# EAGLE schematic r4 (EAGLE 8.0.1)
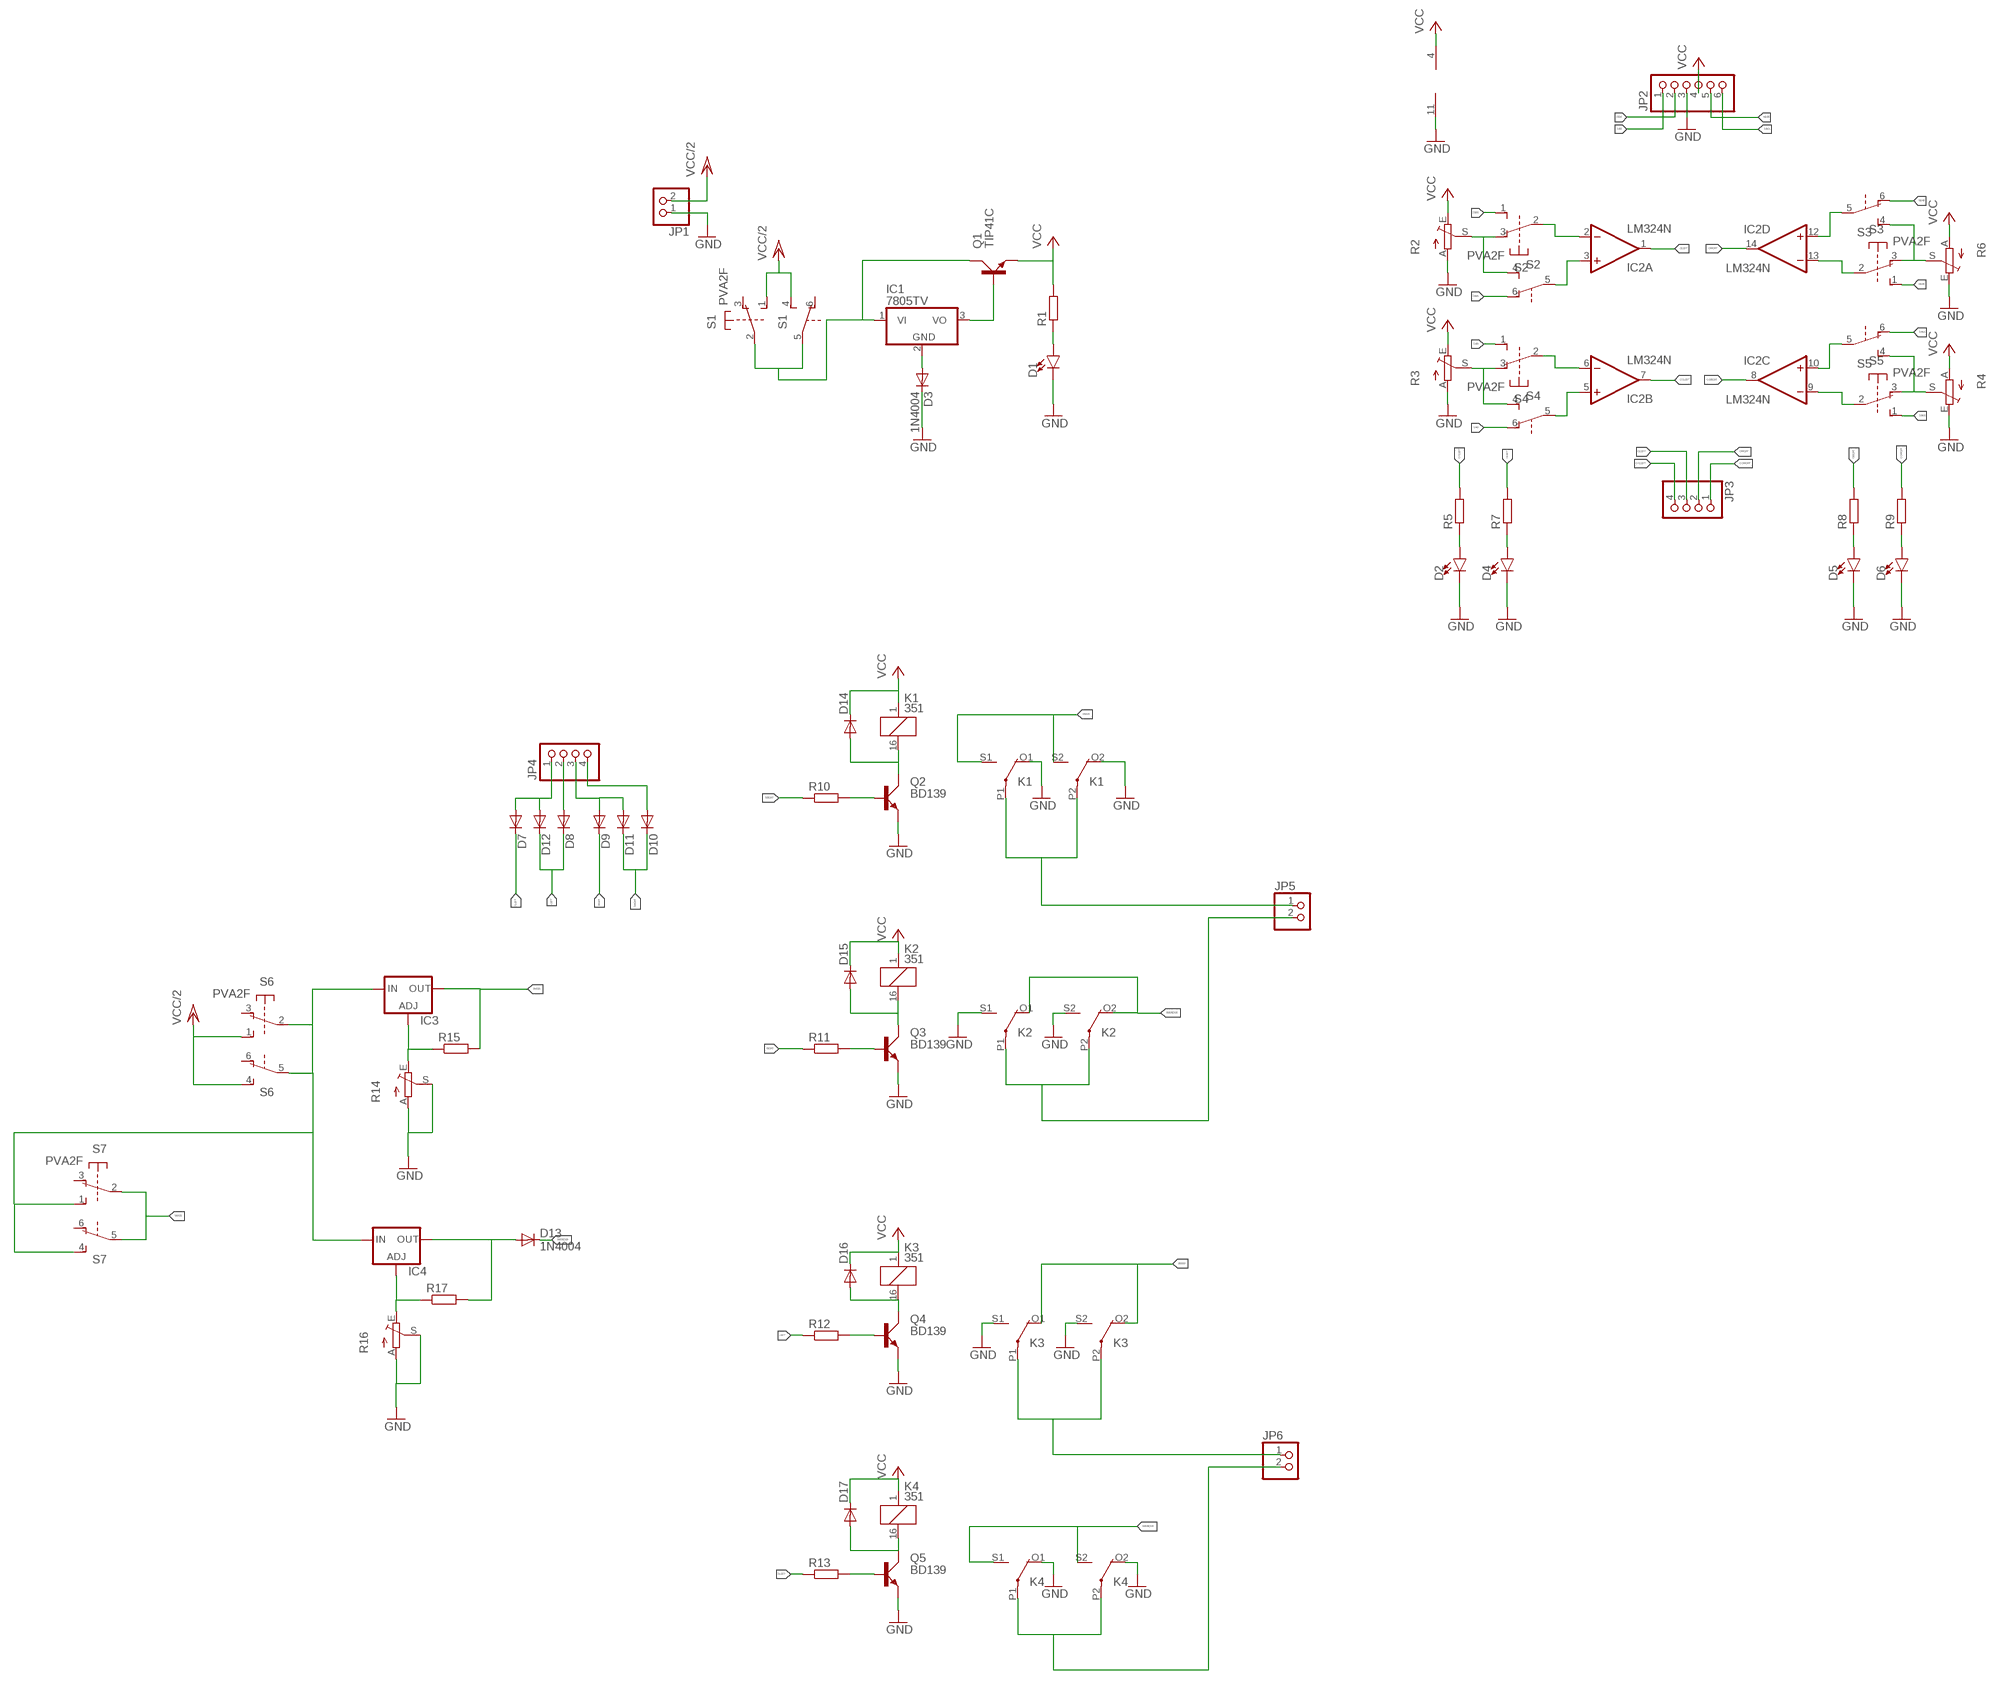
[diagram p0: schematic, sheet 1]

## Parts
D1  LED5MM  [LED_5MM]
D2  LED5MM  [LED_5MM]
D3  1N4004  [DO41-10]
D4  LED5MM  [LED_5MM]
D5  LED5MM  [LED_5MM]
D6  LED5MM  [LED_5MM]
D7  1N4148DO35-7  [DO35-7]
D8  1N4148DO35-7  [DO35-7]
D9  1N4148DO35-7  [DO35-7]
D10  1N4148DO35-7  [DO35-7]
D11  1N4148DO35-7  [DO35-7]
D12  1N4148DO35-7  [DO35-7]
D13  1N4004  [DO41-10]
D14  1N4148DO35-7  [DO35-7]
D15  1N4148DO35-7  [DO35-7]
D16  1N4148DO35-7  [DO35-7]
D17  1N4148DO35-7  [DO35-7]
IC1  7805TV  [TO220V]
IC2  LM324N  [DIL14]
IC3  LM317TS  [317TS]
IC4  LM317TS  [317TS]
JP1  PINHD-1X2  [1X02]
JP2  PINHD-1X6  [1X06]
JP3  PINHD-1X4  [1X04]
JP4  PINHD-1X4  [1X04]
JP5  PINHD-1X2  [1X02]
JP6  PINHD-1X2  [1X02]
K1  351  [351]
K2  351  [351]
K3  351  [351]
K4  351  [351]
Q1  TIP41C  [TO220AV]
Q2  BD139  [TO126AV]
Q3  BD139  [TO126AV]
Q4  BD139  [TO126AV]
Q5  BD139  [TO126AV]
R1  R-EU_0204/7  [0204/7]
R2  TRIM_EU-CA6V  [CA6V]
R3  TRIM_EU-CA6V  [CA6V]
R4  TRIM_EU-CA6V  [CA6V]
R5  R-EU_0204/7  [0204/7]
R6  TRIM_EU-CA6V  [CA6V]
R7  R-EU_0204/7  [0204/7]
R8  R-EU_0204/7  [0204/7]
R9  R-EU_0204/7  [0204/7]
R10  R-EU_0204/7  [0204/7]
R11  R-EU_0204/7  [0204/7]
R12  R-EU_0204/7  [0204/7]
R13  R-EU_0204/7  [0204/7]
R14  TRIM_EU-CA6V  [CA6V]
R15  R-EU_0204/7  [0204/7]
R16  TRIM_EU-CA6V  [CA6V]
R17  R-EU_0204/7  [0204/7]
S1  PVA2F  [PVA2F]
S2  PVA2F  [PVA2F]
S3  PVA2F  [PVA2F]
S4  PVA2F  [PVA2F]
S5  PVA2F  [PVA2F]
S6  PVA2F  [PVA2F]
S7  PVA2F  [PVA2F]

## Nets
DEKI: JP2.2 S2.1(1:S) S2.6(2:O)
GND: D1.K(C) D2.K(C) D3.C D4.K(C) D5.K(C) D6.K(C) IC2.11(P:V-) JP1.1 JP2.3 K1.O1(2:O) K1.O2(3:O) K2.S1(2:S) K2.S2(3:S) K3.S1(2:S) K3.S2(3:S) K4.O1(2:O) K4.O2(3:O) Q2.E Q3.E Q4.E Q5.E R2.A R3.A R4.E R6.E R14.A R14.S R16.A R16.S
LEFT: D8.C D12.C R12.1
N$1: D3.A IC1.2(GND)
N$2: IC1.1(VI) Q1.C S1.2(1:P) S1.5(2:P)
N$3: IC1.3(VO) Q1.B
N$4: D1.A R1.1
N$5: R2.S S2.3(1:O) S2.4(2:S)
N$6: IC2.2(A:-IN) S2.2(1:P)
N$7: IC2.3(A:+IN) S2.5(2:P)
N$8: R6.S S3.3(1:O) S3.4(2:S)
N$9: IC2.13(D:-IN) S3.2(1:P)
N$10: IC2.12(D:+IN) S3.5(2:P)
N$11: R3.S S4.3(1:O) S4.4(2:S)
N$12: IC2.6(B:-IN) S4.2(1:P)
N$13: IC2.5(B:+IN) S4.5(2:P)
N$14: R4.S S5.3(1:O) S5.4(2:S)
N$15: IC2.9(C:-IN) S5.2(1:P)
N$16: IC2.10(C:+IN) S5.5(2:P)
N$17: D2.A R5.1
N$18: D4.A R7.1
N$19: D5.A R8.1
N$20: D6.A R9.1
N$21: D7.A D12.A JP4.1
N$22: D8.A JP4.2
N$23: D9.A D11.A JP4.3
N$24: D10.A JP4.4
N$25: Q2.B R10.2
N$26: Q3.B R11.2
N$27: Q4.B R12.2
N$28: Q5.B R13.2
N$29: D14.A K1.16 Q2.C
N$30: IC3.1(ADJ) R14.E R15.1
N$31: IC4.1(ADJ) R16.E R17.1
N$32: D15.A K2.16 Q3.C
N$34: D16.A K3.16 Q4.C
N$35: JP5.1 K1.P1(2:P) K1.P2(3:P)
N$36: JP5.2 K2.P1(2:P) K2.P2(3:P)
N$37: D17.A K4.16 Q5.C
N$38: JP6.1 K3.P1(2:P) K3.P2(3:P)
N$39: JP6.2 K4.P1(2:P) K4.P2(3:P)
N$40: D13.A IC4.2(OUT) R17.2
N$41: IC3.3(IN) IC4.3(IN) S6.2(1:P) S6.5(2:P) S7.1(1:S) S7.4(2:S)
N$48: JP2.5 S3.1(1:S) S3.6(2:O)
OLEFT: IC2.1(A:OUT) JP3.3 R7.2
ORIGHT: IC2.14(D:OUT) JP3.2 R8.2
OSLEFT: IC2.7(B:OUT) JP3.4 R5.2
OSRIGHT: IC2.8(C:OUT) JP3.1 R9.2
RIGHT: D9.C R11.1
SAKA: JP2.6 S5.1(1:S) S5.6(2:O)
SAKI: JP2.1 S4.1(1:S) S4.6(2:O)
SLEFT: D7.C R13.1
SRIGHT: D10.C D11.C R10.1
VCC: D14.C D15.C D16.C D17.C IC2.4(P:V+) JP2.4 K1.1 K2.1 K3.1 K4.1 Q1.E R1.2 R2.E R3.E R4.A R6.A
VCC/2: JP1.2 S1.1(1:S) S1.4(2:S) S6.1(1:S) S6.4(2:S)
VMAJU: IC3.2(OUT) K1.S1(2:S) K1.S2(3:S) K3.O1(2:O) K3.O2(3:O) R15.2 S7.2(1:P) S7.5(2:P)
VMUNDUR: D13.C K2.O1(2:O) K2.O2(3:O) K4.S1(2:S) K4.S2(3:S)
Unconnected: S1.3(1:O) S1.6(2:O) S6.3(1:O) S6.6(2:O) S7.3(1:O) S7.6(2:O)

## Library data of the parts
D1 D2 D4-D6 = SparkFun-LED:LED: LED (Generic) Standard schematic elements and footprints for 5mm, 3mm, 1206, and 0603 sized LEDs. Generic LEDs with no color specified.
D3 D13 = diode:1N4004: DIODE general purpose rectifier, 1 A
D7-D12 D14-D17 = diode:1N4148: DIODE high speed (Philips)
IC1 = linear:78*: Positive VOLTAGE REGULATOR Source: http://cache.national.com/ds/LM/LM78L05.pdf http://www.fairchildsemi.com/ds/LM/LM7805.pdf
IC2 = linear:LM324: OP AMP
IC3 IC4 = v-reg:LM317TS: VOLTAGE REGULATOR
JP1 JP5 JP6 = pinhead:PINHD-1X2: PIN HEADER
JP2 = pinhead:PINHD-1X6: PIN HEADER
JP3 JP4 = pinhead:PINHD-1X4: PIN HEADER
K1-K4 = relay:351: RELAY 2 x switch, Omron; OC_FARNELL: unknown; OC_NEWARK: unknown
Q1 = transistor-power:TIP41C: NPN TRANSISTOR
Q2-Q5 = transistor-power:BD139: NPN TRANSISTOR
R1 R5 R7-R13 R15 R17 = resistor:R-EU_: RESISTOR, European symbol
R2-R4 R6 R14 R16 = pot:TRIM_EU-: POTENTIOMETER
S1-S7 = switch-misc:PVA2: ITT SWITCH